# EAGLE schematic Solar Simulator (EAGLE 8.1.0)
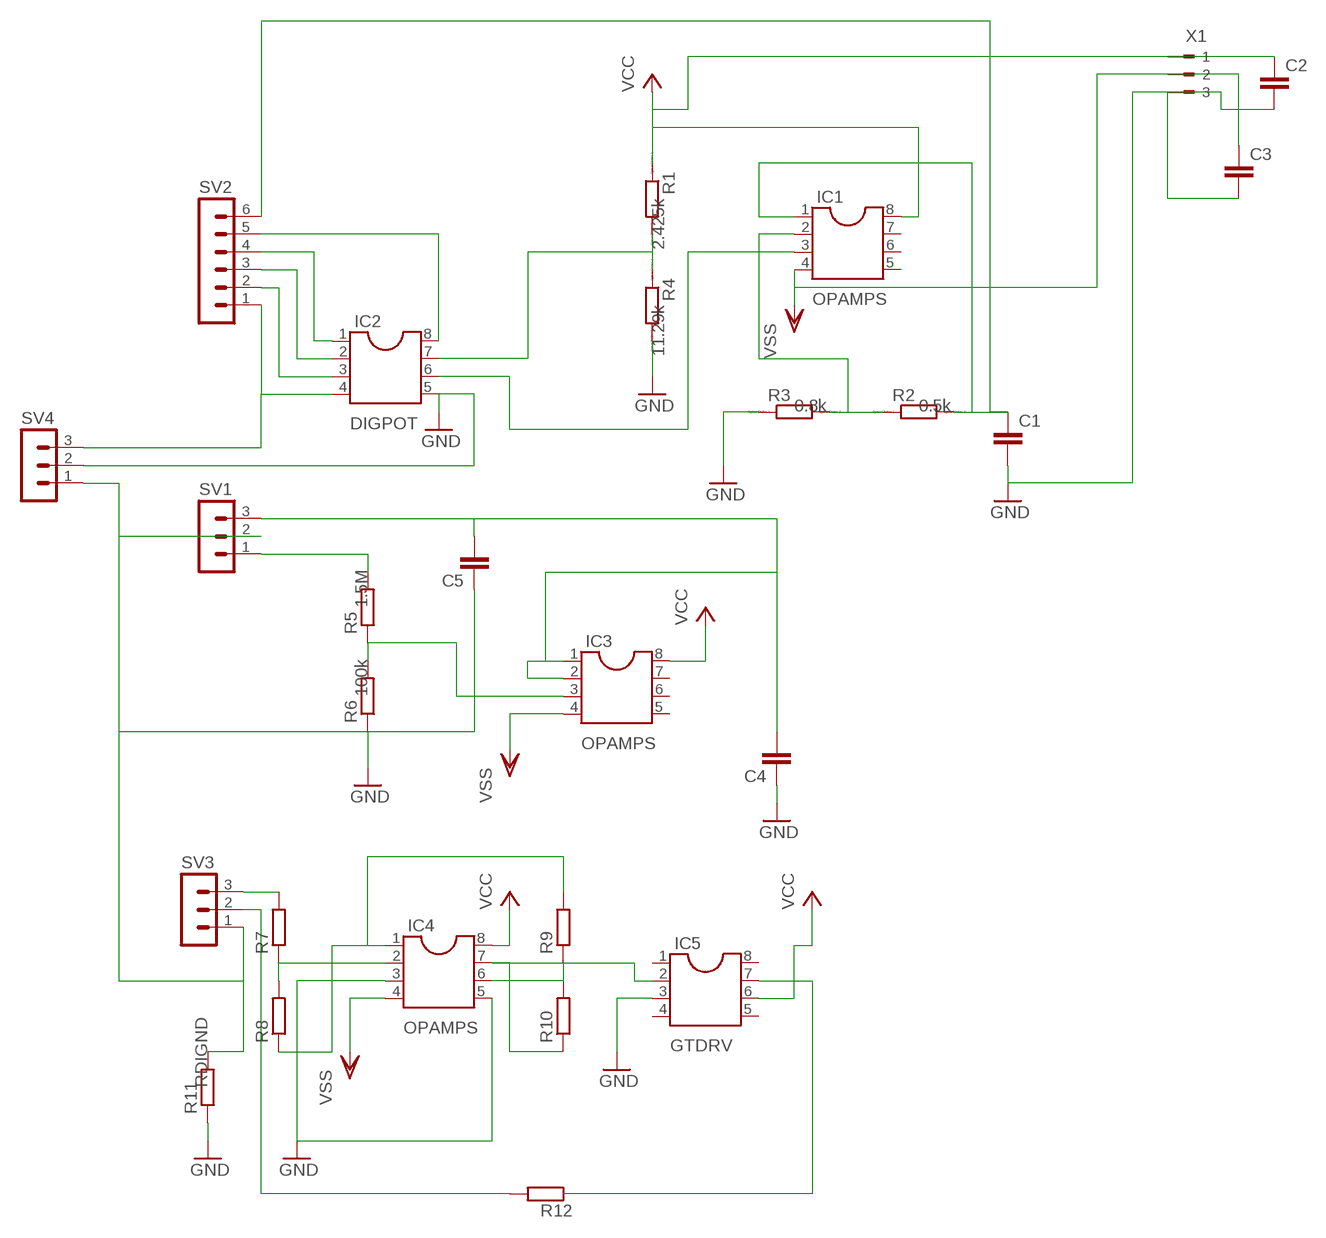
[diagram p0: schematic, sheet 1]

## Parts
C1  C5/2.5  [C5B2.5]
C2  C5/2.5  [C5B2.5]
C3  C5/2.5  [C5B2.5]
C4  C5/2.5  [C5B2.5]
C5  C5/2.5  [C5B2.5]
IC1  DIL8S  [SOCKET-08]
IC2  DIL8S  [SOCKET-08]
IC3  DIL8S  [SOCKET-08]
IC4  DIL8S  [SOCKET-08]
IC5  DIL8S  [SOCKET-08]
R1  R0207/10  [0207/10]
R2  R0207/10  [0207/10]
R3  R0207/10  [0207/10]
R4  R0207/10  [0207/10]
R5  R-EU_0207/10  [0207/10]
R6  R-EU_0207/10  [0207/10]
R7  R-EU_0207/10  [0207/10]
R8  R-EU_0207/10  [0207/10]
R9  R-EU_0207/10  [0207/10]
R10  R-EU_0207/10  [0207/10]
R11  R-EU_0207/10  [0207/10]
R12  R-EU_0207/10  [0207/10]
SV1  MA03-1  [MA03-1]
SV2  MA06-1  [MA06-1]
SV3  MA03-1  [MA03-1]
SV4  MA03-1  [MA03-1]
X1  90-3  [90-3]

## Nets
GND: C1.2 C2.2 C3.2 C4.1 IC2.5 IC4.3 IC4.5 IC5.3 R3.1 R4.2 R6.1 R11.1 SV4.2 X1.3
N$1: IC1.2 R2.1 R3.2
N$2: IC1.3 IC2.6
N$3: IC2.1 SV2.4
N$4: C1.1 IC1.1 R2.2 SV2.6
N$5: IC2.7 R1.2 R4.1
N$6: IC2.2 SV2.3
N$7: IC2.3 SV2.2
N$8: IC2.4 SV2.1 SV4.3
N$9: IC3.3 R5.1 R6.2
N$10: R12.2 SV3.2
N$12: IC2.8 SV2.5
N$14: C4.2 C5.2 IC3.1 IC3.2 SV1.3
N$15: R5.2 SV1.1
N$18: R7.2 SV3.3
N$19: IC4.2 R7.1 R8.2
N$20: IC4.1 R8.1 R9.2
N$21: IC4.6 R9.1 R10.2
N$22: IC4.7 IC5.2 R10.1
N$23: IC5.7
N$24: C5.1 R11.2 SV1.2 SV3.1 SV4.1
VCC: C2.1 IC1.8 IC3.8 IC4.8 IC5.6 R1.1 X1.1
VSS: C3.1 IC1.4 IC3.4 IC4.4 X1.2
Unconnected: IC1.5 IC1.6 IC1.7 IC3.5 IC3.6 IC3.7 IC5.1 IC5.4 IC5.5 IC5.8 R12.1

## Library data of the parts
C1-C5 = capacitor-wima:C: CAPACITOR naming: grid - package width
IC1-IC5 = ic-package:DIL8: Dual In Line / Socket
R1 = eagle-ltspice:R: RESISTOR, European symbol; SPICEMODEL: 2.425k; SPICEPREFIX: R
R2 = eagle-ltspice:R: RESISTOR, European symbol; SPICEMODEL: 0.5k; SPICEPREFIX: R
R3 = eagle-ltspice:R: RESISTOR, European symbol; SPICEMODEL: 0.8k; SPICEPREFIX: R
R4 = eagle-ltspice:R: RESISTOR, European symbol; SPICEMODEL: 11.29k; SPICEPREFIX: R
R5 = rcl:R-EU_: RESISTOR, European symbol; RR: 1.5M
R6 = rcl:R-EU_: RESISTOR, European symbol; RR2: 100k
R7-R12 = rcl:R-EU_: RESISTOR, European symbol
SV1 SV3 SV4 = con-lstb:MA03-1: PIN HEADER; OC_FARNELL: unknown; OC_NEWARK: unknown
SV2 = con-lstb:MA06-1: PIN HEADER; OC_FARNELL: unknown; OC_NEWARK: unknown
X1 = con-weidmueller-sl35:90-3: WEIDMUELLER CLAMP CONNECTOR; OC_FARNELL: unknown; OC_NEWARK: unknown

## Net classes
0 default: width 0.381 mm, drill 0.559 mm, clearance 0.381 mm